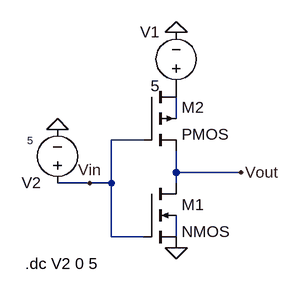
[diagram p0: schematic CMOS_Static.asc]
CMOS_Static.asc, the LTspice schematic file:
Version 4
SHEET 1 880 680
WIRE 144 112 144 80
WIRE 96 144 48 144
WIRE 144 192 144 160
WIRE 240 192 144 192
WIRE 16 208 -32 208
WIRE 48 208 48 144
WIRE 48 208 16 208
WIRE 144 208 144 192
WIRE 48 288 48 208
WIRE 96 288 48 288
WIRE 144 288 144 256
FLAG 144 -16 0
FLAG 144 304 0
FLAG 240 192 Vout
FLAG -32 128 0
FLAG 16 208 Vin
SYMBOL nmos4 96 208 R0
SYMATTR InstName M1
SYMBOL pmos4 96 64 R0
SYMATTR InstName M2
SYMBOL voltage 144 80 R180
WINDOW 0 24 96 Left 2
WINDOW 3 24 16 Left 2
WINDOW 123 0 0 Left 0
WINDOW 39 0 0 Left 0
SYMATTR InstName V1
SYMATTR Value 5
SYMBOL voltage -32 224 R180
WINDOW 3 36 79 Left 1
WINDOW 123 0 0 Left 0
WINDOW 39 0 0 Left 0
SYMATTR Value 5
SYMATTR InstName V2
TEXT -80 328 Left 2 !.dc V2 0 5

The netlist it stands for:
* CMOS_Static.asc
M1 Vout Vin 0 N002 NMOS
M2 P001 Vin Vout N001 PMOS
V1 P001 0 5
V2 Vin 0 5
.model NMOS NMOS
.model PMOS PMOS
.lib standard.mos
.dc V2 0 5
.backanno
.end